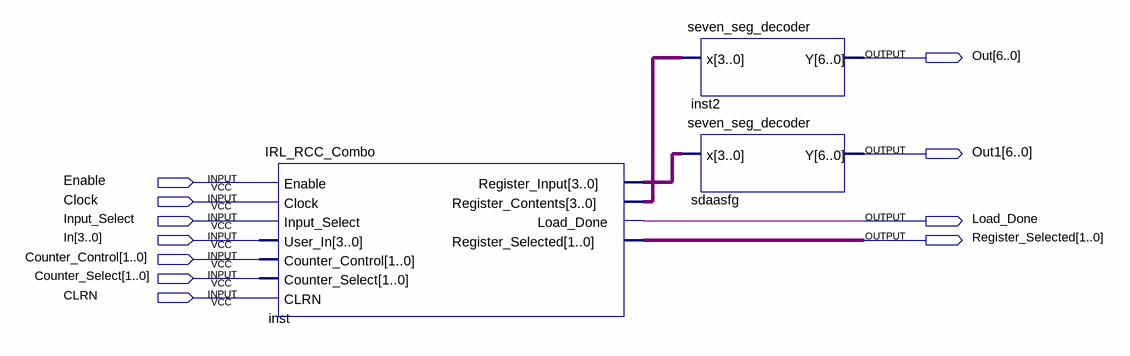
[diagram p0: schematic sheet]
// Quartus schematic IRL_RCC_Combo_Test.bdf as structural Verilog: 3 symbols, 11 pins
module IRL_RCC_Combo_Test (
  input  Enable,
  input  Clock,
  input  Input_Select,
  input  [3:0] In,
  input  [1:0] Counter_Control,
  input  [1:0] Counter_Select,
  input  CLRN,
  output [6:0] Out,
  output [6:0] Out1,
  output Load_Done,
  output [1:0] Register_Selected
);

  wire [3:0] inst_register_contents, inst_register_input;

  IRL_RCC_Combo inst (
    .Enable(Enable), .Clock(Clock), .Input_Select(Input_Select), .User_In(In),
    .Counter_Control(Counter_Control), .Counter_Select(Counter_Select), .CLRN(CLRN),
    .Register_Input(inst_register_input), .Register_Contents(inst_register_contents), .Load_Done(Load_Done),
    .Register_Selected(Register_Selected));
  seven_seg_decoder inst2 (.x(inst_register_contents), .Y(Out));
  seven_seg_decoder sdaasfg (.x(inst_register_input), .Y(Out1));
endmodule
